# EAGLE schematic schemat (EAGLE 7.7.0)
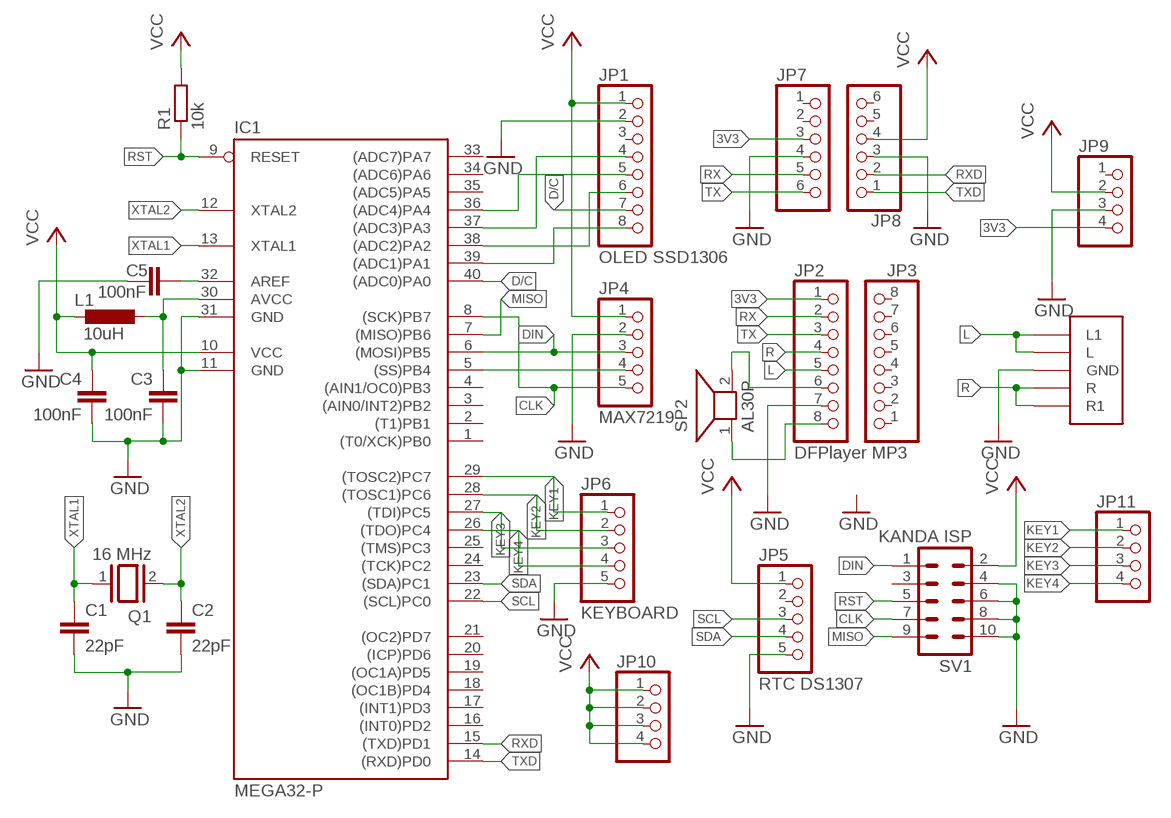
[diagram p0: schematic, sheet 1]

## Parts
C1  22pF  C-EU025-025X050  [C025-025X050]
C2  22pF  C-EU025-025X050  [C025-025X050]
C3  100nF  C-EU025-025X050  [C025-025X050]
C4  100nF  C-EU025-025X050  [C025-025X050]
C5  100nF  C-EU025-025X050  [C025-025X050]
IC1  MEGA32-P  MEGA16-P  [DIL40]
JP1  OLED SSD1306  PINHD-1X8  [1X08]
JP2  DFPlayer MP3  PINHD-1X8  [1X08]
JP3  PINHD-1X8  [1X08]
JP4  MAX7219  PINHD-1X5  [1X05]
JP5  RTC DS1307  PINHD-1X5  [1X05]
JP6  KEYBOARD  PINHD-1X5  [1X05]
JP7  PINHD-1X6  [1X06]
JP8  PINHD-1X6  [1X06]
JP9  PINHD-1X4  [1X04]
JP10  PINHD-1X4  [1X04]
JP11  PINHD-1X4  [1X04]
L1  10uH  L-EU0204/5  [0204/5]
Q1  16 MHz  XTAL/S  [QS]
R1  10k  R-EU_0207/7  [0207/7]
SP2  AL30P  [AL30P]
SV1  KANDA ISP  ML10  [ML10]
U$1  STEREO_D  [STEREO_P]

## Nets
3V3: JP2.1 JP7.3 JP9.4
AVCC: C3.1 IC1.30(AVCC) L1.1
CLK: IC1.8((SCK)PB7) JP4.5 SV1.7
CS: IC1.5((SS)PB4) JP4.4
D/C: IC1.40((ADC0)PA0) JP1.7
DIN: IC1.6((MOSI)PB5) JP4.3 SV1.1
GND: C1.2 C2.2 C3.2 C4.2 C5.2 IC1.11(GND) IC1.31(GND) JP1.2 JP2.7 JP4.2 JP5.5 JP6.5 JP7.4 JP8.3 JP9.3 SV1.4 SV1.6 SV1.8 SV1.10 U$1.GND
KEY1: IC1.29((TOSC2)PC7) JP6.1 JP11.1
KEY2: IC1.28((TOSC1)PC6) JP6.2 JP11.2
KEY3: IC1.27((TDI)PC5) JP6.3 JP11.3
KEY4: IC1.26((TDO)PC4) JP6.4 JP11.4
L: JP2.5 U$1.L_A(L1) U$1.L_B(L)
MISO: IC1.7((MISO)PB6) SV1.9
N$2: C5.1 IC1.32(AREF)
N$4: JP2.8 SP2.1
N$5: JP2.6 SP2.2
N$9: IC1.37((ADC3)PA3) JP1.4
N$10: IC1.38((ADC2)PA2) JP1.6
N$11: IC1.36((ADC4)PA4) JP1.5
R: JP2.4 U$1.R_A(R1) U$1.R_B(R)
RST: IC1.9(RESET) R1.1 SV1.5
RST_SSD: IC1.39((ADC1)PA1) JP1.8
RX: JP2.2 JP7.5
RXD: IC1.15((TXD)PD1) JP8.2
SCL: IC1.22((SCL)PC0) JP5.3
SDA: IC1.23((SDA)PC1) JP5.4
TX: JP2.3 JP7.6
TXD: IC1.14((RXD)PD0) JP8.1
VCC: C4.1 IC1.10(VCC) JP1.1 JP4.1 JP5.1 JP8.4 JP9.2 JP10.1 JP10.2 JP10.3 JP10.4 L1.2 R1.2 SV1.2
XTAL1: C1.1 IC1.13(XTAL1) Q1.1
XTAL2: C2.1 IC1.12(XTAL2) Q1.2
Unconnected: IC1.1((T0/XCK)PB0) IC1.2((T1)PB1) IC1.3((AIN0/INT2)PB2) IC1.4((AIN1/OC0)PB3) IC1.16((INT0)PD2) IC1.17((INT1)PD3) IC1.18((OC1B)PD4) IC1.19((OC1A)PD5) IC1.20((ICP)PD6) IC1.21((OC2)PD7) IC1.24((TCK)PC2) IC1.25((TMS)PC3) IC1.33((ADC7)PA7) IC1.34((ADC6)PA6) IC1.35((ADC5)PA5) JP1.3 JP3.1 JP3.2 JP3.3 JP3.4 JP3.5 JP3.6 JP3.7 JP3.8 JP5.2 JP7.1 JP7.2 JP8.5 JP8.6 JP9.1 SV1.3

## Library data of the parts
C1-C5 = resistor:C-EU: CAPACITOR, European symbol
IC1 = atmel:MEGA16-P: MICROCONTROLLER 16 Kbytes FLASH 1 kbytes SRAM 512 bytes EEPROM USART 8-channel 10 bit ADC Source: avr.lbr; MPN: ATMEGA16-16PU; OC_FARNELL: 9171142; OC_NEWARK: 01M6885
JP1-JP3 = pinhead:PINHD-1X8: PIN HEADER
JP4-JP6 = pinhead:PINHD-1X5: PIN HEADER
JP7 JP8 = pinhead:PINHD-1X6: PIN HEADER
JP9-JP11 = pinhead:PINHD-1X4: PIN HEADER
L1 = resistor:L-EU: INDUCTOR, European symbol
Q1 = special:XTAL/S: CRYSTAL
R1 = resistor:R-EU_: RESISTOR, European symbol
SP2 = buzzer:AL30P: SPEAKER Source: Buerklin; OC_FARNELL: unknown; OC_NEWARK: unknown
SV1 = con-ml:ML10: HARTING; OC_FARNELL: unknown; OC_NEWARK: unknown
U$1 = forAnia:STEREO_D